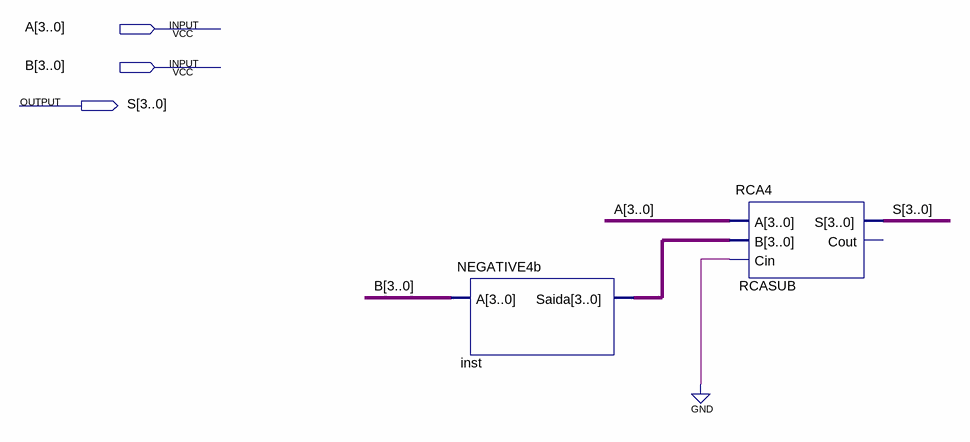
[diagram p0: schematic sheet]
// Quartus schematic SUB4b.bdf as structural Verilog: 2 symbols, 3 pins
module SUB4b (
  input  [3:0] A,
  input  [3:0] B,
  output [3:0] S
);

  wire [3:0] inst_saida;

  NEGATIVE4b inst (.A(B), .Saida(inst_saida));
  RCA4 RCASUB (.A(A), .B(inst_saida), .Cin(1'b0), .S(S));  // open: Cout
endmodule
